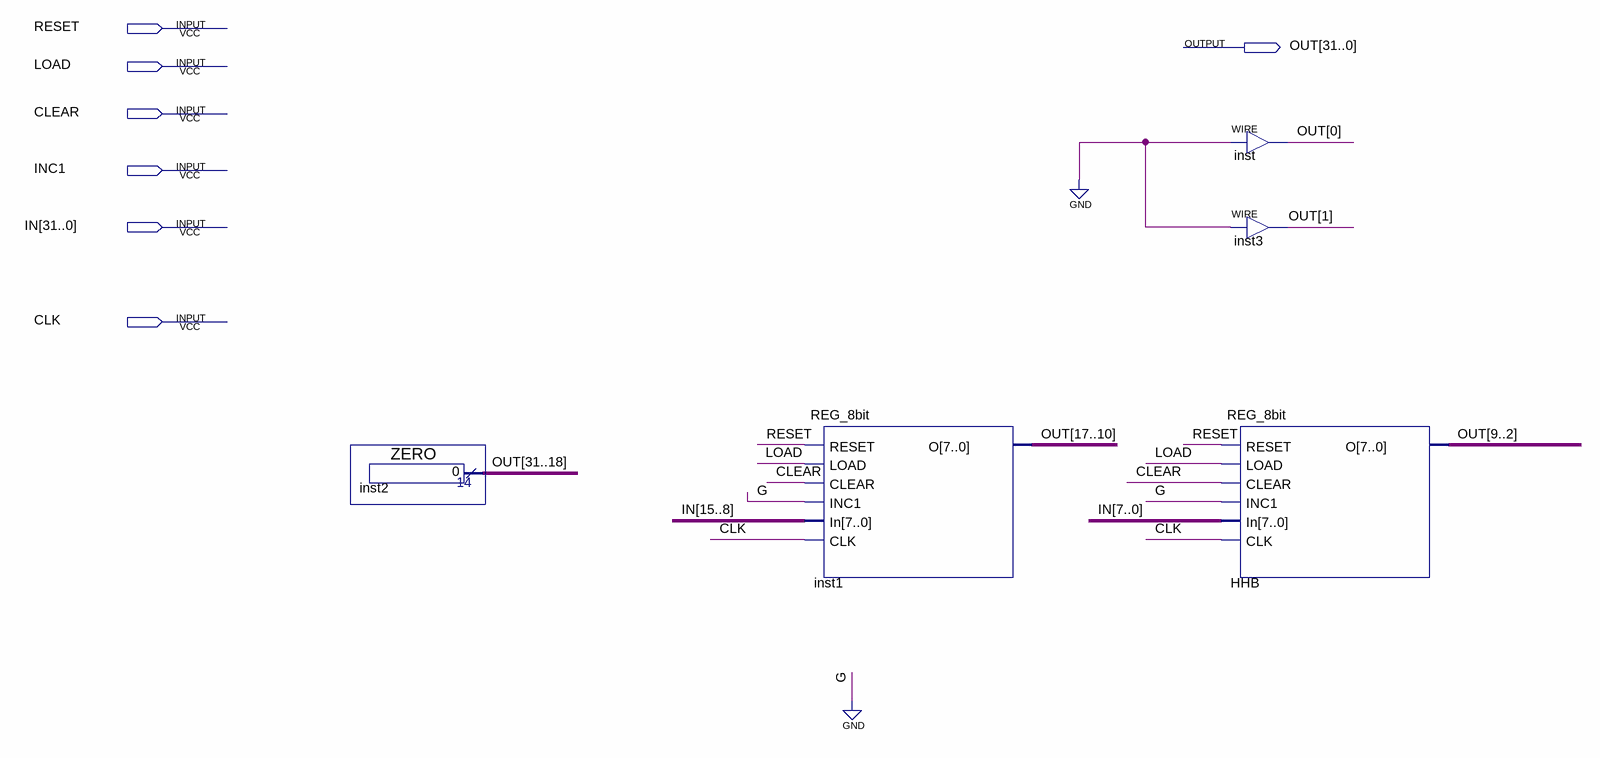
[diagram p0: schematic sheet]
// Quartus schematic CPP.bdf as structural Verilog: 5 symbols, 7 pins
module CPP (
  input  RESET,
  input  LOAD,
  input  CLEAR,
  input  INC1,
  input  [31:0] IN,
  input  CLK,
  output [31:0] OUT
);

  ZERO inst2 (.result(OUT[31:18]));
  REG_8bit inst1 (.RESET(RESET), .LOAD(LOAD), .CLEAR(CLEAR), .INC1(1'b0), .In(IN[15:8]), .CLK(CLK), .O(OUT[17:10]));
  assign OUT[0] = 1'b0;  // WIRE inst
  assign OUT[1] = 1'b0;  // WIRE inst3
  REG_8bit HHB (.RESET(RESET), .LOAD(LOAD), .CLEAR(CLEAR), .INC1(1'b0), .In(IN[7:0]), .CLK(CLK), .O(OUT[9:2]));
endmodule
